# EAGLE schematic 03-eagleClass-555-led-battery (EAGLE 7.6.0)
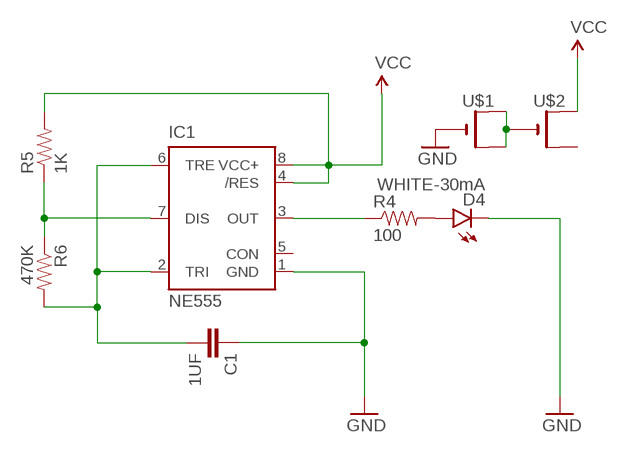
[diagram p0: schematic, sheet 1]

## Parts
C1  1UF  CAP_  [AXIAL-5MM]
D4  WHITE-30mA  LED5MM  [LED5MM]
IC1  NE555  [DIL-08]
R4  100  1KOHM-1/4W-5%(PTH)HORIZ-KIT  [AXIAL-0.3EZ]
R5  1K  1KOHM-1/4W-5%(PTH)HORIZ-KIT  [AXIAL-0.3EZ]
R6  470K  1KOHM-1/4W-5%(PTH)HORIZ-KIT  [AXIAL-0.3EZ]
U$1  CR2032THM  [CR2032-THRU]
U$2  CR2032THM  [CR2032-THRU]

## Nets
DISCHARGE: IC1.7(DIS) R5.P$1 R6.P$1
GND: C1.P$1 D4.K(C) IC1.1(GND) U$1.-
N$2: D4.A R4.P$2
N$3: IC1.2(TRI)
N$4: U$1.+1(+) U$1.+2(+1) U$2.-
OUT: IC1.3(OUT) R4.P$1
THRESHOLD: C1.P$2 IC1.6(TRE) R6.P$2
VCC: IC1.4(/RES) IC1.8(VCC+) R5.P$2 U$2.+1(+)
Unconnected: IC1.5(CON) U$2.+2(+1)

## Library data of the parts
C1 = SparkFun-Capacitors:CAP: Capacitor Standard 0603 ceramic capacitor, and 0.1" leaded capacitor.; PROD_ID: 445-8517-ND
D4 = SparkFun-LED:LED: LEDs Standard schematic elements and footprints for 5mm, 3mm, 1206, and 0603 sized LEDs. 5mm - Spark Fun Electronics SKU : COM-00529 (and others); PROD_ID: 67-2062-ND
IC1 = st-microelectronics:NE555: General purpose bipolar Timer; MF: Arrow Electronics; MPN: NE555N; OC_FARNELL: 1467742; OC_NEWARK: 89K1486; PROD_ID: 296-1857-5-ND
R4 R6 = SparkFun-Resistors:1KOHM-1/4W-5%(PTH): RES-08380; PROD_ID: RES-08380; VALUE: 1k
R5 = SparkFun-Resistors:1KOHM-1/4W-5%(PTH): RES-08380; PROD_ID: 1.0KQBK-ND; VALUE: 1k
U$1 U$2 = adafruit:CR2032